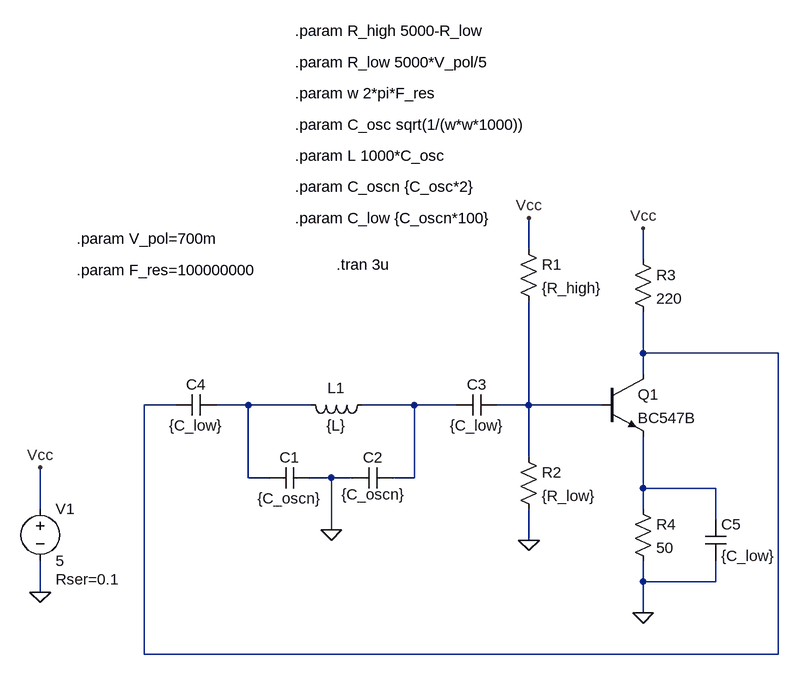
[diagram p0: schematic Colpitts100Mhz.asc]
Colpitts100Mhz.asc, the LTspice schematic file:
Version 4
SHEET 1 1324 680
WIRE 512 -160 512 -208
WIRE 688 -144 688 -192
WIRE 688 0 688 -64
WIRE 896 0 688 0
WIRE 688 32 688 0
WIRE -32 80 -80 80
WIRE 80 80 32 80
WIRE 176 80 80 80
WIRE 336 80 256 80
WIRE 400 80 336 80
WIRE 512 80 512 -80
WIRE 512 80 464 80
WIRE 624 80 512 80
WIRE 512 160 512 80
WIRE 80 192 80 80
WIRE 112 192 80 192
WIRE 208 192 176 192
WIRE 240 192 208 192
WIRE 336 192 336 80
WIRE 336 192 304 192
WIRE 688 208 688 128
WIRE 800 208 688 208
WIRE -240 240 -240 176
WIRE 688 240 688 208
WIRE 800 256 800 208
WIRE 208 272 208 192
WIRE 512 288 512 240
WIRE 688 352 688 320
WIRE 800 352 800 320
WIRE 800 352 688 352
WIRE -240 368 -240 320
WIRE 688 400 688 352
WIRE -80 464 -80 80
WIRE 896 464 896 0
WIRE 896 464 -80 464
FLAG 208 272 0
FLAG 512 288 0
FLAG 688 400 0
FLAG 688 -192 Vcc
FLAG 512 -208 Vcc
FLAG -240 176 Vcc
FLAG -240 368 0
SYMBOL cap 176 176 R90
WINDOW 0 0 32 VBottom 2
WINDOW 3 32 32 VTop 2
SYMATTR InstName C1
SYMATTR Value {C_oscn}
SYMBOL cap 304 176 R90
WINDOW 0 0 32 VBottom 2
WINDOW 3 57 31 VBottom 2
SYMATTR InstName C2
SYMATTR Value {C_oscn}
SYMBOL ind 272 64 R90
WINDOW 0 5 56 VBottom 2
WINDOW 3 32 56 VTop 2
SYMATTR InstName L1
SYMATTR Value {L}
SYMBOL cap 464 64 R90
WINDOW 0 0 32 VBottom 2
WINDOW 3 32 32 VTop 2
SYMATTR InstName C3
SYMATTR Value {C_low}
SYMBOL cap 32 64 R90
WINDOW 0 0 32 VBottom 2
WINDOW 3 32 32 VTop 2
SYMATTR InstName C4
SYMATTR Value {C_low}
SYMBOL npn 624 32 R0
SYMATTR InstName Q1
SYMATTR Value BC547B
SYMBOL res 496 -176 R0
SYMATTR InstName R1
SYMATTR Value {R_high}
SYMBOL res 496 144 R0
SYMATTR InstName R2
SYMATTR Value {R_low}
SYMBOL res 672 -160 R0
SYMATTR InstName R3
SYMATTR Value 220
SYMBOL res 672 224 R0
SYMATTR InstName R4
SYMATTR Value 50
SYMBOL cap 784 256 R0
SYMATTR InstName C5
SYMATTR Value {C_low}
SYMBOL voltage -240 224 R0
WINDOW 123 0 0 Left 0
WINDOW 39 24 124 Left 2
SYMATTR SpiceLine Rser=0.1
SYMATTR InstName V1
SYMATTR Value 5
TEXT 216 -136 Left 2 !.tran 3u
TEXT 152 -352 Left 2 !.param C_osc sqrt(1/(w*w*1000))
TEXT 152 -208 Left 2 !.param C_low {C_oscn*100}
TEXT -184 -128 Left 2 !.param F_res=100000000
TEXT 152 -256 Left 2 !.param C_oscn {C_osc*2}
TEXT 152 -496 Left 2 !.param R_high 5000-R_low
TEXT -184 -176 Left 2 !.param V_pol=700m
TEXT 152 -448 Left 2 !.param R_low 5000*V_pol/5
TEXT 152 -304 Left 2 !.param L 1000*C_osc
TEXT 152 -400 Left 2 !.param w 2*pi*F_res

The netlist it stands for:
* Colpitts100Mhz.asc
C1 0 N002 {C_oscn}
C2 N003 0 {C_oscn}
L1 N003 N002 {L}
C3 N004 N003 {C_low}
C4 N002 N001 {C_low}
Q1 N001 N004 N005 0 BC547B
R1 Vcc N004 {R_high}
R2 N004 0 {R_low}
R3 Vcc N001 220
R4 N005 0 50
C5 N005 0 {C_low}
V1 Vcc 0 5 Rser=0.1
.model NPN NPN
.model PNP PNP
.lib standard.bjt
.tran 3u
.param C_osc sqrt(1/(w*w*1000))
.param C_low {C_oscn*100}
.param F_res=100000000
.param C_oscn {C_osc*2}
.param R_high 5000-R_low
.param V_pol=700m
.param R_low 5000*V_pol/5
.param L 1000*C_osc
.param w 2*pi*F_res
.backanno
.end